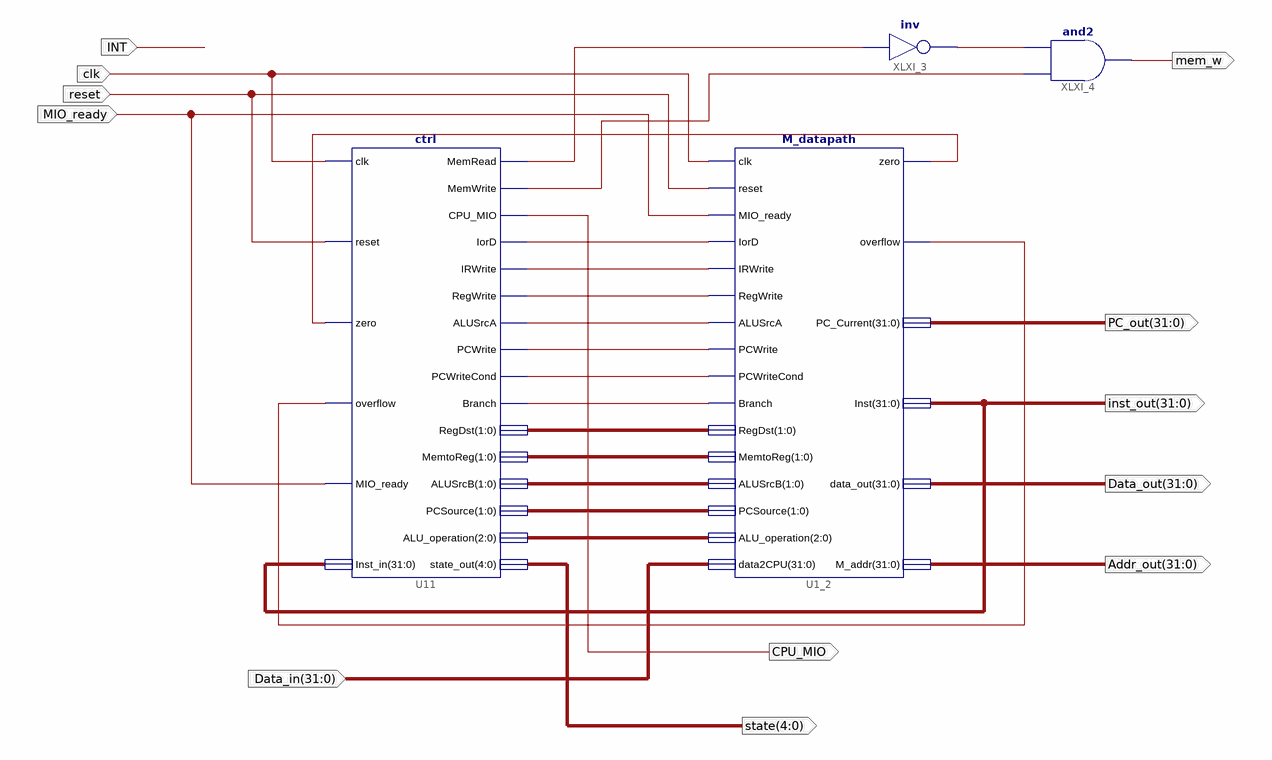
[diagram p0: schematic sheet 1]
// Xilinx ISE schematic Multi_CPU.sch (kintex7) as structural Verilog: 4 symbols, 12 ports
module Multi_CPU (
  input  clk,
  input  reset,
  input  MIO_ready,
  input  INT,
  input  [31:0] Data_in,
  output [31:0] inst_out,
  output [4:0] state,
  output [31:0] PC_out,
  output [31:0] Data_out,
  output [31:0] Addr_out,
  output CPU_MIO,
  output mem_w
);

  wire XLXN_1, XLXN_2, XLXN_3, XLXN_4, XLXN_5, XLXN_7, XLXN_8, XLXN_19, XLXN_32, XLXN_33, XLXN_34, XLXN_36;
  wire [1:0] XLXN_9, XLXN_10, XLXN_11, XLXN_12;
  wire [2:0] XLXN_13;

  M_datapath U1_2 (
    .clk(clk), .reset(reset), .MIO_ready(MIO_ready), .IorD(XLXN_1), .IRWrite(XLXN_2), .RegWrite(XLXN_3),
    .ALUSrcA(XLXN_4), .PCWrite(XLXN_5), .PCWriteCond(XLXN_7), .Branch(XLXN_8), .RegDst(XLXN_9),
    .MemtoReg(XLXN_10), .ALUSrcB(XLXN_11), .PCSource(XLXN_12), .ALU_operation(XLXN_13), .data2CPU(Data_in),
    .zero(XLXN_19), .overflow(XLXN_36), .PC_Current(PC_out), .Inst(inst_out), .data_out(Data_out),
    .M_addr(Addr_out));
  ctrl U11 (
    .clk(clk), .reset(reset), .zero(XLXN_19), .overflow(XLXN_36), .MIO_ready(MIO_ready), .Inst_in(inst_out),
    .MemRead(XLXN_32), .MemWrite(XLXN_34), .CPU_MIO(CPU_MIO), .IorD(XLXN_1), .IRWrite(XLXN_2),
    .RegWrite(XLXN_3), .ALUSrcA(XLXN_4), .PCWrite(XLXN_5), .PCWriteCond(XLXN_7), .Branch(XLXN_8),
    .RegDst(XLXN_9), .MemtoReg(XLXN_10), .ALUSrcB(XLXN_11), .PCSource(XLXN_12), .ALU_operation(XLXN_13),
    .state_out(state));
  not XLXI_3 (XLXN_33, XLXN_32);
  and XLXI_4 (mem_w, XLXN_34, XLXN_33);
endmodule
